# Altium schematic sheet Peripheral.SchDoc
size A4
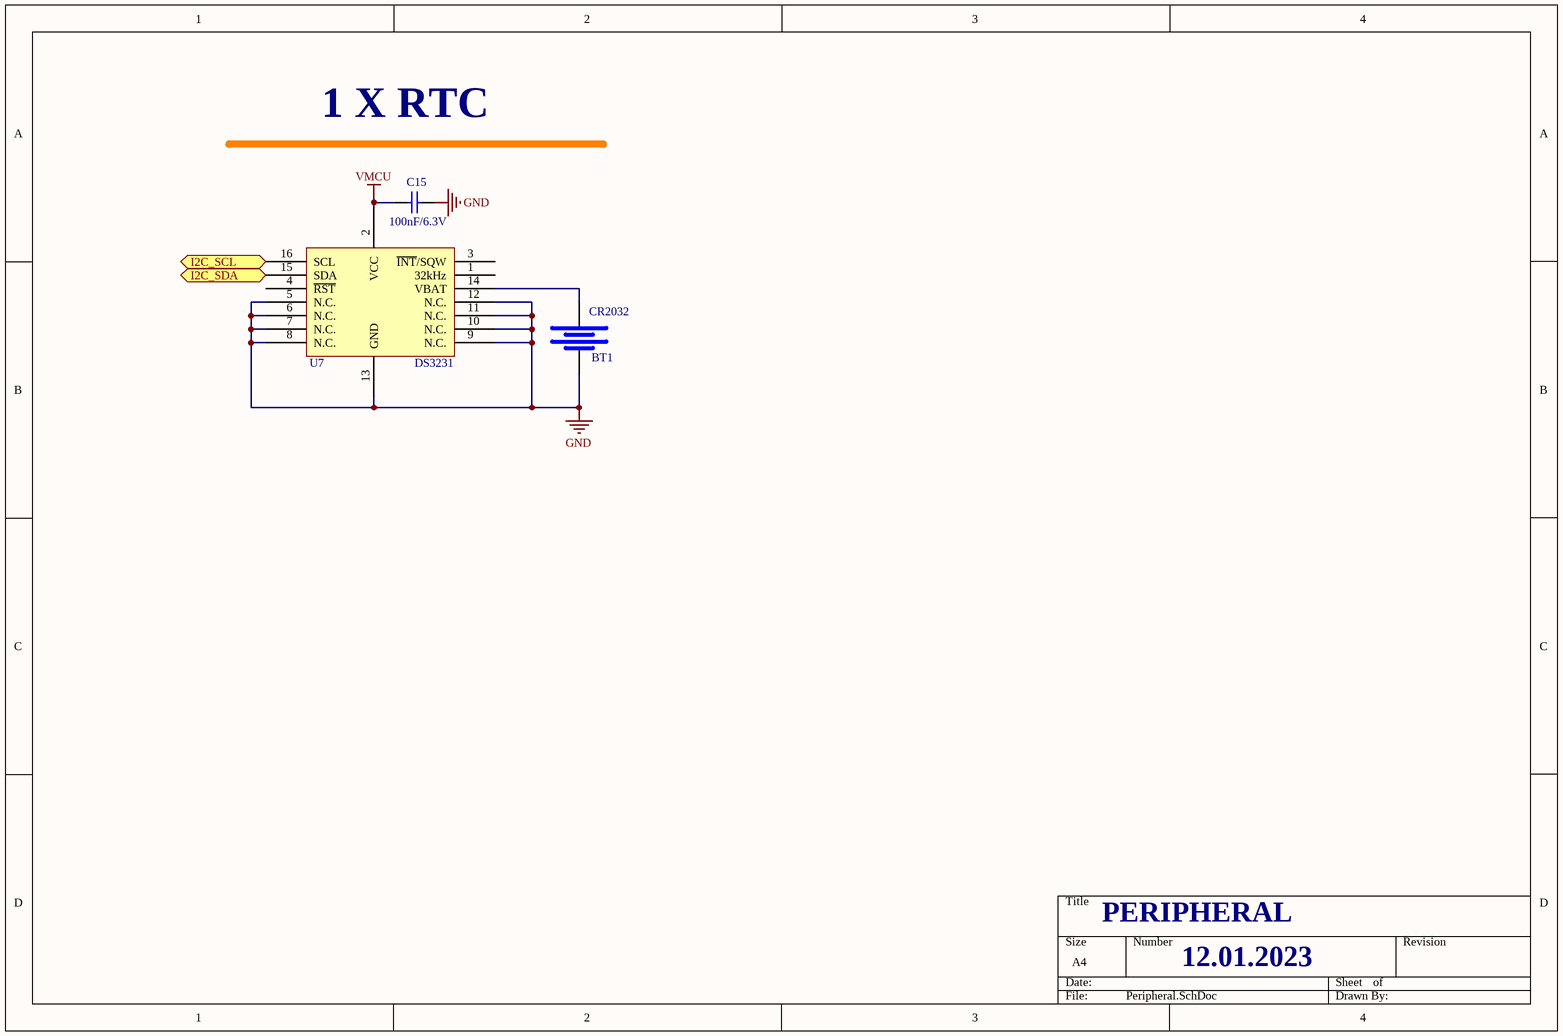
[diagram p0: Peripheral.SchDoc]

## Parts
BT1  CR2032  [CR2032]
C15  100nF/6.3V  [CAP0603W]
U7  DS3231  [SOIC16]

## Ports
I2C_SCL, I2C_SDA

## Nets
GND: BT1.2(-) C15.2 U7.5(N.C.) U7.6(N.C.) U7.7(N.C.) U7.8(N.C.) U7.9(N.C.) U7.10(N.C.) U7.11(N.C.) U7.12(N.C.) U7.13(GND)
VMCU: C15.1 U7.2(VCC)
I2C_SCL: U7.16(SCL) ; port I2C_SCL
I2C_SDA: U7.15(SDA) ; port I2C_SDA
NetBT1_1: BT1.1(+) U7.14(VBAT)

Not connected (* = marked no-connect by the designer): U7 1(32kHz) 3(~{INT}/SQW) 4(~{RST})

## Notes on the sheet
- 1 X RTC
- PERIPHERAL
- 12.01.2023

## Library data of the parts
BT1 = BATTERY_CR2032: BATTERY CR2032 HORIZONTAL 3PIN
C15 = CAP1: CAPACITOR 0603 Case; Value: 100nF; Published: 8-Jun-2000; LatestRevisionDate: 17-Jul-2002; LatestRevisionNote: Re-released for DXP Platform.; PackageReference: C1206; Publisher: Altium Limited
U7 = RTC_DS3231: IC DS3231SN RTC W/TCXO 16-SOIC MAXIM